# Altium schematic sheet voltage_selection.SchDoc: Voltage Input Selection
size A4; Author: Robocup; Organization: Hamburg Bit-Bots; Address1: Vogt-Kölln-Str. 30; Address2: 225257 Hamburg; Address3: Germany; Address4: www.bit-bots.de; DocumentNumber: 3; Revision: A; SheetNumber: 3; SheetTotal: 7; EMail: info@bit-bots.de
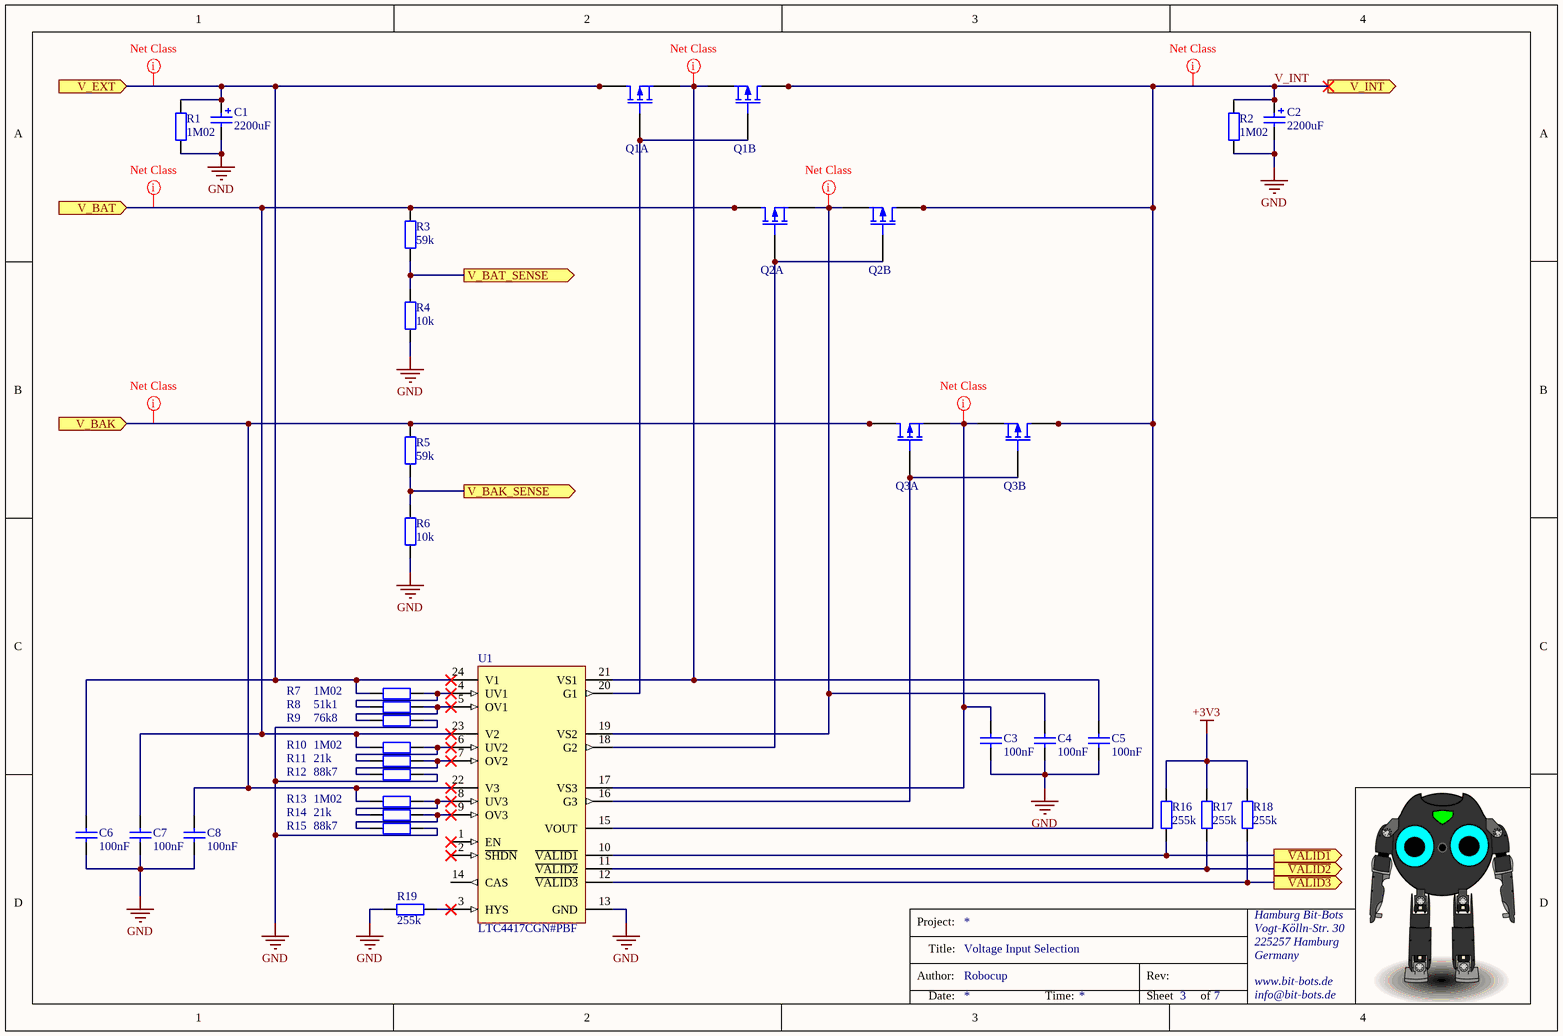
[diagram p0: voltage_selection.SchDoc]

## Parts
C1  2200uF  [Cap 16mm]
C2  2200uF  [Cap 16mm]
C3  100nF  [C2012]
C4  100nF  [C2012]
C5  100nF  [C2012]
C6  100nF  [C2012]
C7  100nF  [C2012]
C8  100nF  [C2012]
Q1  IRF7324  [SOIC8]  (value not drawn)  (parts A,B of 2)
Q2  IRF7324  [SOIC8]  (value not drawn)  (parts A,B of 2)
Q3  IRF7324  [SOIC8]  (value not drawn)  (parts A,B of 2)
R1  1M02  [R2012]
R2  1M02  [R2012]
R3  59k  [R2012]
R4  10k  [R2012]
R5  59k  [R2012]
R6  10k  [R2012]
R7  1M02  [R2012]
R8  51k1  [R2012]
R9  76k8  [R2012]
R10  1M02  [R2012]
R11  21k  [R2012]
R12  88k7  [R2012]
R13  1M02  [R2012]
R14  21k  [R2012]
R15  88k7  [R2012]
R16  255k  [R2012]
R17  255k  [R2012]
R18  255k  [R2012]
R19  255k  [R2012]
U1  LTC4417CGN#PBF  [SSOP24]

## Ports
V_BAK (in), V_BAK_SENSE (out), V_BAT (in), V_BAT_SENSE (out), V_EXT (in), V_INT (out), ~{VALID1} (out), ~{VALID2} (out), ~{VALID3} (out)

## Nets
+3V3: R16.1 R17.1 R18.1
GND: C1.2 C2.2 C3.1 C4.1 C5.1 C6.1 C7.1 C8.1 R1.1 R2.1 R4.1 R6.1 R9.1 R12.1 R15.1 R19.2 U1.13(GND)
~{VALID1}: R16.2 U1.10(~{VALID1}) ; port ~{VALID1}
~{VALID2}: R17.2 U1.11(~{VALID2}) ; port ~{VALID2}
~{VALID3}: R18.2 U1.12(~{VALID3}) ; port ~{VALID3}
V_BAK: C8.2 Q3.7(D1) Q3.8(D1) R5.2 R13.2 U1.22(V3) ; port V_BAK
V_BAK_SENSE: R5.1 R6.2 ; port V_BAK_SENSE
V_BAT: C7.2 Q2.7(D1) Q2.8(D1) R3.2 R10.2 U1.23(V2) ; port V_BAT
V_BAT_SENSE: R3.1 R4.2 ; port V_BAT_SENSE
V_EXT: C1.1 C6.2 Q1.7(D1) Q1.8(D1) R1.2 R7.2 U1.24(V1) ; port V_EXT
V_INT: C2.1 Q1.5(D2) Q1.6(D2) Q2.5(D2) Q2.6(D2) Q3.5(D2) Q3.6(D2) R2.2 U1.15(VOUT) ; port V_INT
NetC3_2: C3.2 Q3.1(S2) Q3.3(S2) U1.17(VS3)
NetC4_2: C4.2 Q2.1(S2) Q2.3(S2) U1.19(VS2)
NetC5_2: C5.2 Q1.1(S2) Q1.3(S2) U1.21(VS1)
NetQ1_2: Q1.2(G1) Q1.4(G2) U1.20(G1)
NetQ2_2: Q2.2(G1) Q2.4(G2) U1.18(G2)
NetQ3_2: Q3.2(G1) Q3.4(G2) U1.16(G3)
NetR7_1: R7.1 R8.1 U1.4(UV1)
NetR8_2: R8.2 R9.2 U1.5(OV1)
NetR10_1: R10.1 R11.1 U1.6(UV2)
NetR11_2: R11.2 R12.2 U1.7(OV2)
NetR13_1: R13.1 R14.1 U1.8(UV3)
NetR14_2: R14.2 R15.2 U1.9(OV3)
NetR19_1: R19.1 U1.3(HYS)

Not connected (* = marked no-connect by the designer): U1 1(EN)* 2(~{SHDN})* 14(CAS)

## Layout directives
net class HighCurrent: NetC3_2, NetC4_2, NetC5_2, V_BAK, V_BAT, V_EXT, V_INT

## Notes on the sheet
- Project:
- Author:
- Title:
- Rev:
- Date:
- Time:
- Sheet
- of

## Library data of the parts
C1 C2 = Cap Pol2: Polarized Capacitor (Axial); Published: 8-Jun-2000; LatestRevisionDate: 17-Jul-2002; LatestRevisionNote: Re-released for DXP Platform.; PackageReference: POLAR0.8; Publisher: Altium Limited; PackageDescription: Polarized Capacitor; 2 Leads; Value: 2200uF
C3-C8 = Cap: Capacitor; Published: 8-Jun-2000; LatestRevisionDate: 17-Jul-2002; LatestRevisionNote: Re-released for DXP Platform.; PackageReference: RAD-0.3; Publisher: Altium Limited; PackageDescription: Radial Cap, Thru-Hole; 2 Leads; 0.3 in Pin Spacing; Value: 100nF
Q1-Q3 = Dual P-MOSFET: Dual-Channel P-Mosfet with default Pins
R1-R19 = Res2: Resistor; Published: 8-Jun-2000; LatestRevisionDate: 17-Jul-2002; LatestRevisionNote: Re-released for DXP Platform.; PackageReference: AXIAL-0.4; Publisher: Altium Limited; PackageDescription: Axial Device, Thru-Hole; 2 Leads; 0.4 in Pin Spacing
  R1 R2 R7 R10 R13: Value: 1M02
  R3 R5: Value: 59k
  R4 R6: Value: 10k
  R8: Value: 51k1
  R9: Value: 76k8
  R11 R14: Value: 21k
  R12 R15: Value: 88k7
  R16-R19: Value: 255k
U1 = CMP-0479-00126-1: Prioritized PowerPath Controller, 2.5 to 36 V Vin, 24-pin SOP (GN-24), 0 to 70 degC, Pb-Free; Manufacturer: Linear Technology; Ideal Diode: Triple, External, P-Channel; ComponentLink2Description: Datasheet; PackageDescription: 24-Pin Plastic SSOP , Body 8.5 x 3.9 mm, Pitch 0.635 mm; Mounting Technology: Surface Mount; ComponentLink1Description: Manufacturer URL; ComponentLink2URL: http://cds.linear.com/docs/en/datasheet/4417f.pdf; ComponentLink3Description: Package Specification; ComponentLink1URL: http://www.linear.com/; ComponentLink3URL: http://cds.linear.com/docs/en/packaging/05081641_B_GN24.pdf; PartNumber: LTC4417CGN#PBF; PackageReference: GN24; PackageVersion: Rev. B, 03/2012; RoHS: TRUE